# Altium project Rear_Power_Distribution.PrjPcb
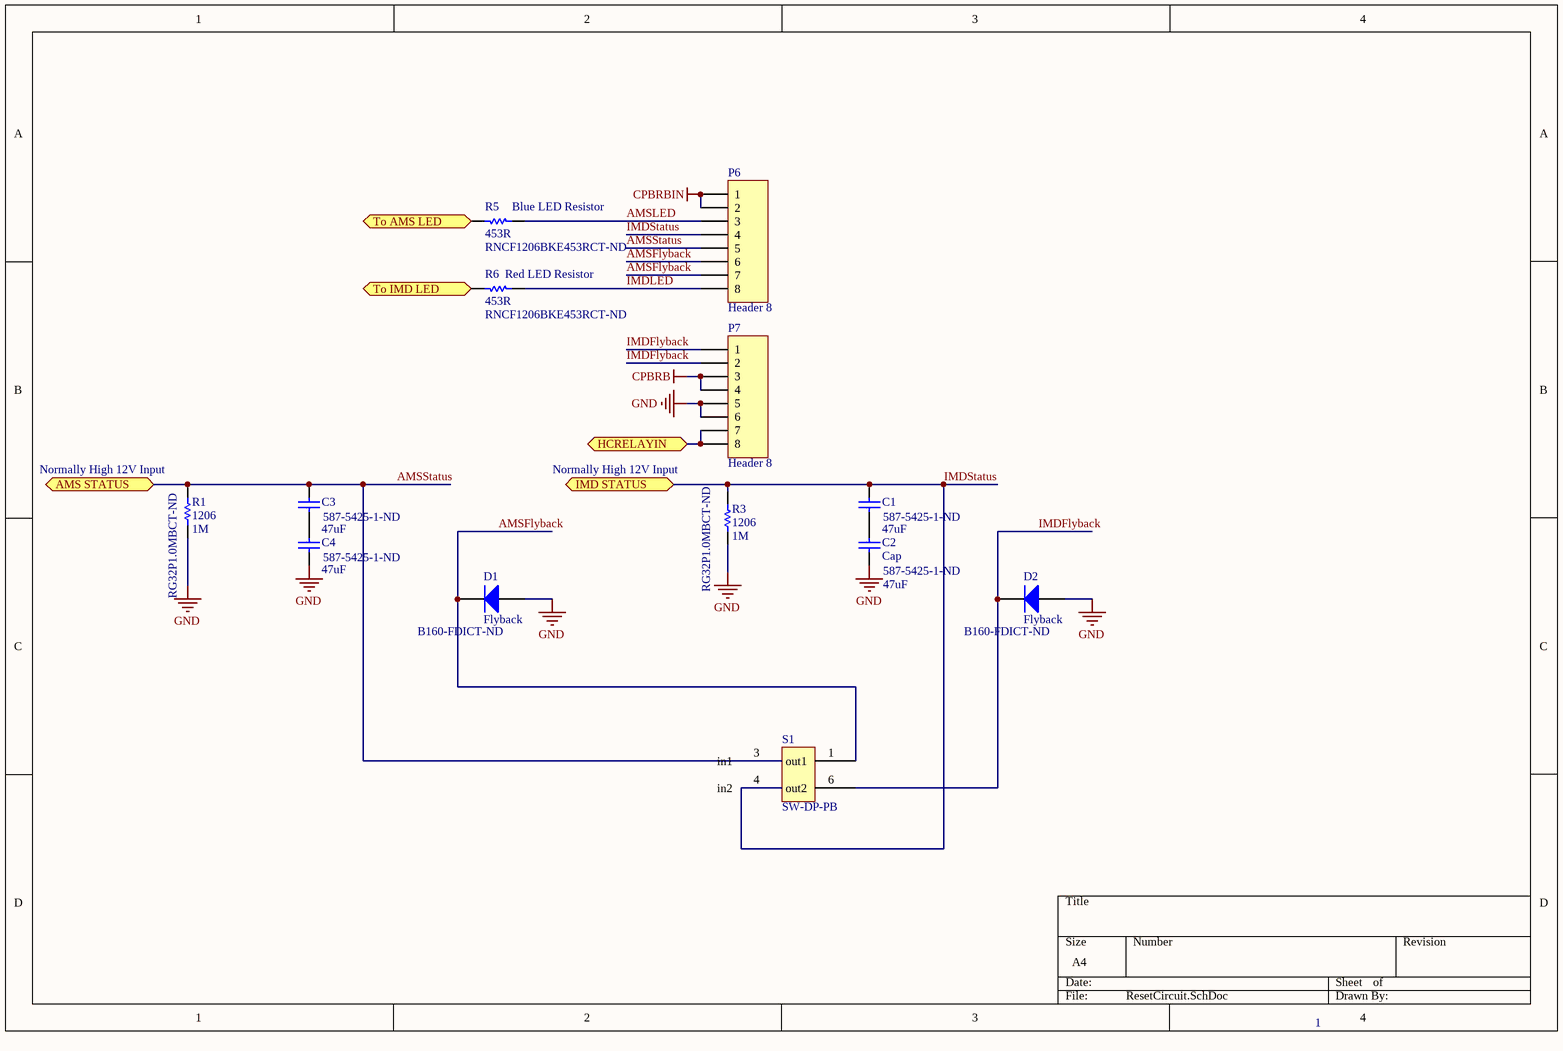
[diagram p0: ResetCircuit.SchDoc]
4 sheets, 55 parts. Net scope: flat (ports and power ports of the same name join across sheets).
Board file: RPD_top.PcbDoc
Sheets:
  ResetCircuit.SchDoc
  FuelPump.SchDoc
  Rear Power Dist.SchDoc
  Fusing_Connectors.SchDoc

## Sheet ResetCircuit.SchDoc
size A4; Date: 2017-12-21; DrawnBy: Tylynn Haddow; Revision: 2; DocumentName: Reset Circuit

### Parts
C1  value 47uF  Supplier Part Number 1: 587-5425-1-ND  [C1206]  (hidden comment: Cap)
C2  Cap  value 47uF  Supplier Part Number 1: 587-5425-1-ND  [C1206]
C3  value 47uF  Supplier Part Number 1: 587-5425-1-ND  [C1206]  (hidden comment: Cap)
C4  value 47uF  Supplier Part Number 1: 587-5425-1-ND  [C1206]  (hidden comment: Cap)
D1  Flyback  Supplier Part Number 1: B160-FDICT-ND  [DO-214AC, SMA]
D2  Flyback  Supplier Part Number 1: B160-FDICT-ND  [DO-214AC, SMA]
P6  Header 8  [HDR1X8]
P7  Header 8  [HDR1X8]
R1  1206  value 1M  Supplier Part Number 1: RG32P1.0MBCT-ND  [1206 (High Density)]
R3  1206  value 1M  Supplier Part Number 1: RG32P1.0MBCT-ND  [1206 (High Density)]
R5  Blue LED Resistor  value 453R  Supplier Part Number 1: RNCF1206BKE453RCT-ND  [C1206]
R6  Red LED Resistor  value 453R  Supplier Part Number 1: RNCF1206BKE453RCT-ND  [C1206]
S1  SW-DP-PB  [SW-DP-PB]

### Ports
AMS STATUS (bidir), HCRELAYIN (bidir), IMD STATUS (bidir), To AMS LED (bidir), To IMD LED (bidir)

### Nets
CPBRB: P7.3 P7.4
CPBRBIN: P6.1 P6.2
GND: C2.1 C4.1 D1.1(A) D2.1(A) P7.5 P7.6 R1.1 R3.1
AMSFlyback: D1.2(K) P6.6 P6.7 S1.1(out1)
AMSLED: P6.3 R5.2
AMSStatus: C3.2 P6.5 R1.2 S1.3(in1) ; port AMS STATUS
IMDFlyback: D2.2(K) P7.1 P7.2 S1.6(out2)
IMDLED: P6.8 R6.2
IMDStatus: C1.2 P6.4 R3.2 S1.4(in2) ; port IMD STATUS
NetC1_1: C1.1 C2.2
NetC3_1: C3.1 C4.2
NetP7_7: P7.7 P7.8 ; port HCRELAYIN
NetR5_1: R5.1 ; port To AMS LED
NetR6_1: R6.1 ; port To IMD LED

### Notes on the sheet
- (near R1) Normally High 12V Input
- Normally High 12V Input
- 1

### Library data of the parts
C1-C4 = Cap: Capacitor; Published: 8-Jun-2000; LatestRevisionDate: 17-Jul-2002; LatestRevisionNote: Re-released for DXP Platform.; PackageReference: RAD-0.3; Publisher: Altium Limited; PackageDescription: Radial Cap, Thru-Hole; 2 Leads; 0.3 in Pin Spacing
  C3 C4: Supplier 1: Digikey
D1 D2 = Diode: Default Diode; Published: 8-Jun-2000; LatestRevisionDate: 17-Jul-2002; LatestRevisionNote: Re-released for DXP Platform.; PackageVersion: Sep-1996; PackageReference: SMC; Publisher: Altium Limited; PackageDescription: DO-214-AB/SMC; 2 C-Bend Leads; Body 7.9 x 5.9 mm, inc. leads (LxW); Code_JEDEC: DO-214-AB; Supplier 1: Digi-Key
P6 = Header 8: Header, 8-Pin, A98338-ND; LatestRevisionDate: 17-Jul-2002; LatestRevisionNote: Re-released for DXP Platform.; Publisher: Altium Limited; Supplier Part Number 1: A98338-ND; Supplier 1: Digikey
P7 = Header 8: Header, 8-Pin A98338-ND; LatestRevisionDate: 17-Jul-2002; LatestRevisionNote: Re-released for DXP Platform.; Publisher: Altium Limited; Supplier Part Number 1: A98338-ND; Supplier 1: Digikey
R1 R3 R5 R6 = Res1: Resistor; Published: 8-Jun-2000; LatestRevisionDate: 17-Jul-2002; LatestRevisionNote: Re-released for DXP Platform.; PackageReference: AXIAL-0.3; Publisher: Altium Limited; PackageDescription: Axial Device, Thru-Hole; 2 Leads; 0.3 in Pin Spacing; Supplier 1: Digi-Key
S1 = SW-DP-PB: Supplier Part Number 1: CKN9865-ND; Supplier 1: Digikey

## Sheet FuelPump.SchDoc
size A4
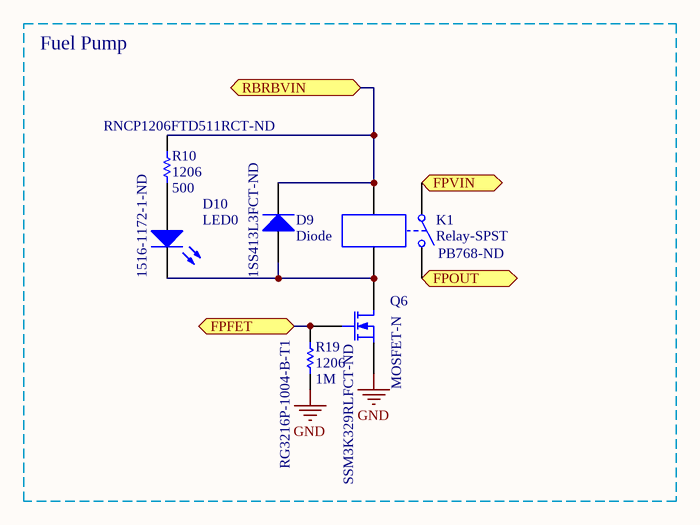
[diagram p1: FuelPump.SchDoc]

### Parts
D9  Diode  Supplier Part Number 1: 1SS413L3FCT-ND  [1SS413]
D10  LED0  Supplier Part Number 1: 1516-1172-1-ND  [C1206]
K1  Relay-SPST  Supplier Part Number 1: PB768-ND  [PB114012]
Q6  MOSFET-N  Supplier Part Number 1: SSM3K329RLFCT-ND  [SOT23f]
R10  1206  value 500  Supplier Part Number 1: RNCP1206FTD511RCT-ND  [C1206]
R19  1206  value 1M  Supplier Part Number 1: RG3216P-1004-B-T1  [1206 (High Density)]

### Blocks framed on the sheet
Fuel Pump: D9 D10 K1 Q6 R10 R19

### Ports
FPFET (bidir), FPOUT (bidir), FPVIN (bidir), RBRBVIN (bidir)

### Nets
GND: Q6.3(S) R19.1
NetD9_1: D9.1(A) D10.2(K) K1.4 Q6.1(D)
NetD9_2: D9.2(K) K1.3 R10.1 ; port RBRBVIN
NetD10_1: D10.1(A) R10.2
NetFPump1_1: K1.1 ; port FPVIN
NetK1_2: K1.2 ; port FPOUT
NetP1_6: Q6.2(G) R19.2 ; port FPFET

### Library data of the parts
D9 = Diode: Switching diode; Published: 8-Jun-2000; LatestRevisionDate: 17-Jul-2002; LatestRevisionNote: Re-released for DXP Platform.; PackageVersion: Sep-1996; PackageReference: SMC; Publisher: Altium Limited; PackageDescription: DO-214-AB/SMC; 2 C-Bend Leads; Body 7.9 x 5.9 mm, inc. leads (LxW); Code_JEDEC: DO-214-AB; Supplier 1: Digi-Key
D10 = LED0: Typical INFRARED GaAs LED; Published: 8-Jun-2000; LatestRevisionDate: 08-Jul-2005; LatestRevisionNote: Mech Layer 1 removed.; PackageReference: LED-0; Publisher: Altium Limited; PackageDescription: LED; 2 Leads; Supplier 1: Digi-Key
K1 = Relay-SPST: Single-Pole Single-Throw Relay; Published: 24-Mar-1999; LatestRevisionDate: 17-Jul-2002; LatestRevisionNote: Re-released for DXP Platform.; PackageReference: MODULE4; Publisher: Altium Limited; Supplier 1: Digi-Key
Q6 = MOSFET-N: N-Channel MOSFET; Published: 8-Jun-2000; LatestRevisionDate: 17-Jul-2002; LatestRevisionNote: Re-released for DXP Platform.; PackageVersion: 1995/1996; PackageReference: E3; Publisher: Altium Limited; PackageDescription: TO, Flat Index; 3 In-Line, Axial Leads; Body Dia. 4.6mm; Lead Dia. 0.5 mm (max); Supplier 1: Digi-Key
R10 R19 = Res1: Resistor; Published: 8-Jun-2000; LatestRevisionDate: 17-Jul-2002; LatestRevisionNote: Re-released for DXP Platform.; PackageReference: AXIAL-0.3; Publisher: Altium Limited; PackageDescription: Axial Device, Thru-Hole; 2 Leads; 0.3 in Pin Spacing; Supplier 1: Digi-Key

## Sheet Rear Power Dist.SchDoc
size A

## Sheet Fusing_Connectors.SchDoc
size A3
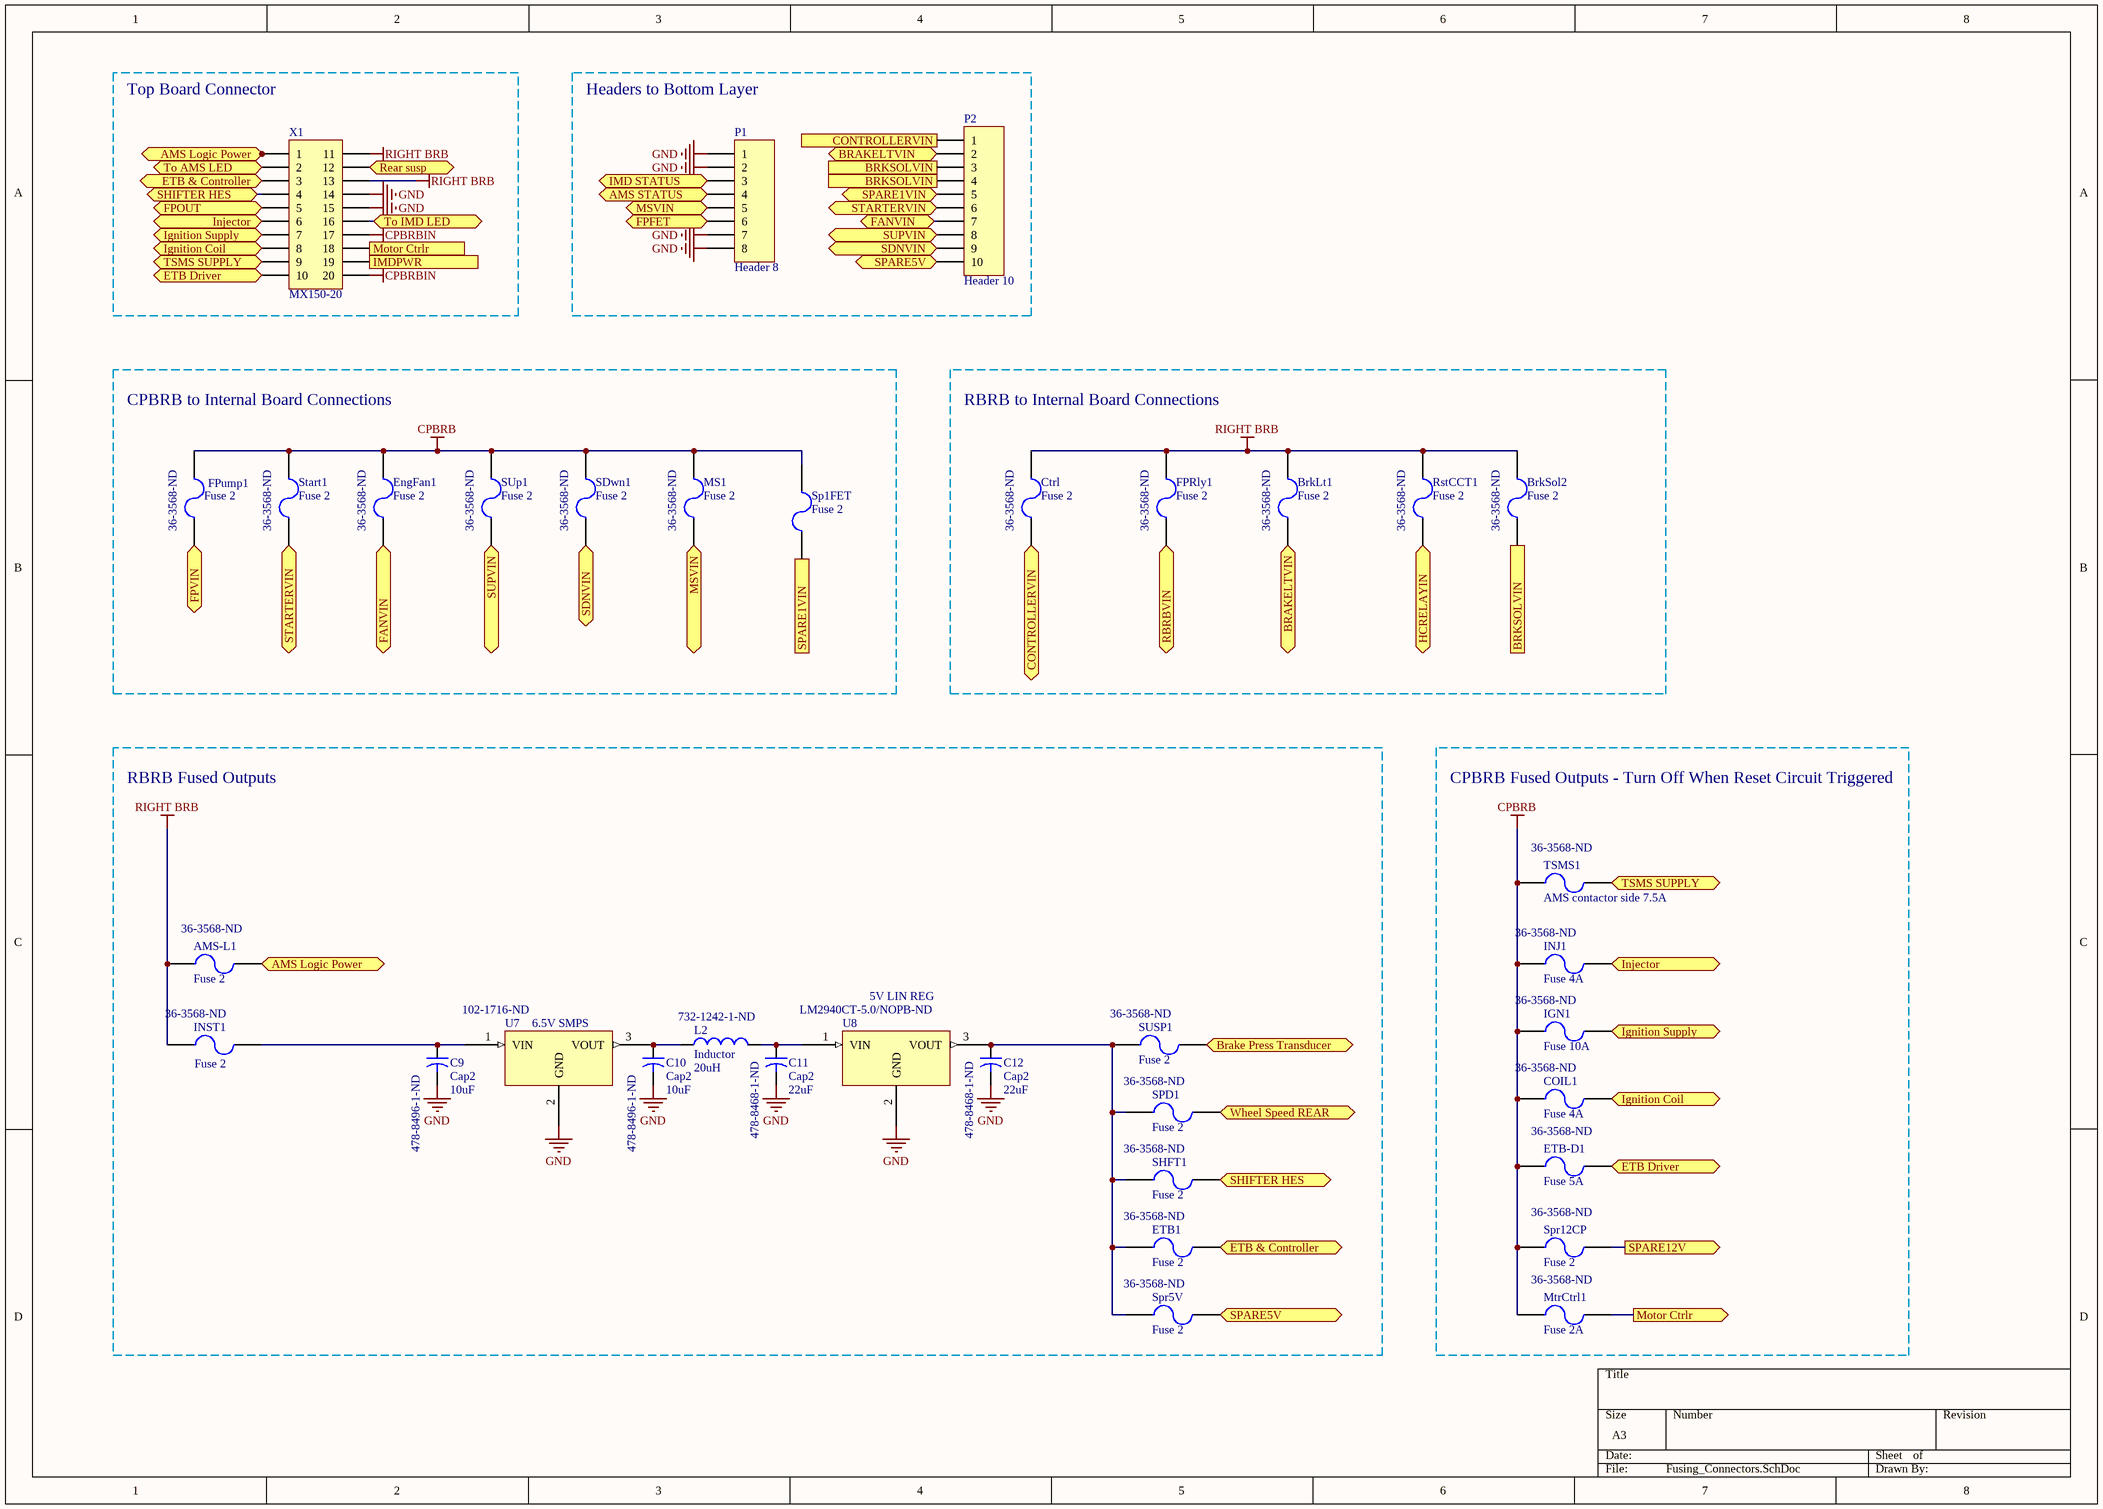
[diagram p2: Fusing_Connectors.SchDoc]

### Parts
AMS-L1  Fuse 2  Supplier Part Number 1: 36-3568-ND  [Fuse Holder Mini ATC/ATO]
BrkLt1  Fuse 2  Supplier Part Number 1: 36-3568-ND  [FUSE HOLDER MINI ATC/ATO]
BrkSol2  Fuse 2  Supplier Part Number 1: 36-3568-ND  [FUSE HOLDER MINI ATC/ATO]
C9  Cap2  value 10uF  Supplier Part Number 1: 478-8496-1-ND  [C1206]
C10  Cap2  value 10uF  Supplier Part Number 1: 478-8496-1-ND  [C1206]
C11  Cap2  value 22uF  Supplier Part Number 1: 478-8468-1-ND  [1206]
C12  Cap2  value 22uF  Supplier Part Number 1: 478-8468-1-ND  [1206]
COIL1  Fuse 4A  Supplier Part Number 1: 36-3568-ND  [Fuse Holder Mini ATC/ATO]
Ctrl  Fuse 2  Supplier Part Number 1: 36-3568-ND  [FUSE HOLDER MINI ATC/ATO]
EngFan1  Fuse 2  Supplier Part Number 1: 36-3568-ND  [FUSE HOLDER MINI ATC/ATO]
ETB1  Fuse 2  Supplier Part Number 1: 36-3568-ND  [Fuse Holder Mini ATC/ATO]
ETB-D1  Fuse 5A  Supplier Part Number 1: 36-3568-ND  [Fuse Holder Mini ATC/ATO]
FPRly1  Fuse 2  Supplier Part Number 1: 36-3568-ND  [FUSE HOLDER MINI ATC/ATO]
FPump1  Fuse 2  Supplier Part Number 1: 36-3568-ND  [FUSE HOLDER MINI ATC/ATO]
IGN1  Fuse 10A  Supplier Part Number 1: 36-3568-ND  [Fuse Holder Mini ATC/ATO]
INJ1  Fuse 4A  Supplier Part Number 1: 36-3568-ND  [Fuse Holder Mini ATC/ATO]
INST1  Fuse 2  Supplier Part Number 1: 36-3568-ND  [Fuse Holder Mini ATC/ATO]
L2  Inductor  value 20uH  Supplier Part Number 1: 732-1242-1-ND  [FILTER INDUCTOR]
MS1  Fuse 2  Supplier Part Number 1: 36-3568-ND  [FUSE HOLDER MINI ATC/ATO]
MtrCtrl1  Fuse 2A  Supplier Part Number 1: 36-3568-ND  [Fuse Holder Mini ATC/ATO]
P1  Header 8  [HDR1X8]
P2  Header 10  [HDR1X10]
RstCCT1  Fuse 2  Supplier Part Number 1: 36-3568-ND  [FUSE HOLDER MINI ATC/ATO]
SDwn1  Fuse 2  Supplier Part Number 1: 36-3568-ND  [FUSE HOLDER MINI ATC/ATO]
SHFT1  Fuse 2  Supplier Part Number 1: 36-3568-ND  [FUSE HOLDER MINI ATC/ATO]
Sp1FET  Fuse 2  [FUSE HOLDER MINI ATC/ATO]
SPD1  Fuse 2  Supplier Part Number 1: 36-3568-ND  [Fuse Holder Mini ATC/ATO]
Spr5V  Fuse 2  Supplier Part Number 1: 36-3568-ND  [Fuse Holder Mini ATC/ATO]
Spr12CP  Fuse 2  Supplier Part Number 1: 36-3568-ND  [Fuse Holder Mini ATC/ATO]
Start1  Fuse 2  Supplier Part Number 1: 36-3568-ND  [FUSE HOLDER MINI ATC/ATO]
SUp1  Fuse 2  Supplier Part Number 1: 36-3568-ND  [FUSE HOLDER MINI ATC/ATO]
SUSP1  Fuse 2  Supplier Part Number 1: 36-3568-ND  [Fuse Holder Mini ATC/ATO]
TSMS1  AMS contactor side 7.5A  Supplier Part Number 1: 36-3568-ND  [Fuse Holder Mini ATC/ATO]
U7  6.5V SMPS  Supplier Part Number 1: 102-1716-ND  [V7806-1000]
U8  5V LIN REG  Supplier Part Number 1: LM2940CT-5.0/NOPB-ND  [TO-220-3]
X1  MX150-20  [20 Pin MX150]

### Blocks framed on the sheet
Top Board Connector: X1
Headers to Bottom Layer: P1 P2
CPBRB to Internal Board Connections: EngFan1 FPump1 MS1 SDwn1 Sp1FET Start1 SUp1
RBRB to Internal Board Connections: BrkLt1 BrkSol2 Ctrl FPRly1 RstCCT1
RBRB Fused Outputs: AMS-L1 C9-C12 ETB1 INST1 L2 SHFT1 SPD1 Spr5V SUSP1 U7 U8
CPBRB Fused Outputs - Turn Off When Reset Circuit Triggered: COIL1 ETB-D1 IGN1 INJ1 MtrCtrl1 Spr12CP TSMS1

### Ports
AMS Logic Power (bidir), AMS STATUS (bidir), Brake Press Transducer (bidir), BRAKELTVIN (bidir), BRKSOLVIN, CONTROLLERVIN, CONTROLLERVIN (bidir), ETB & Controller (bidir), ETB Driver (bidir), FANVIN (bidir), FPFET (bidir), FPOUT (bidir), FPVIN (bidir), HCRELAYIN (bidir), Ignition Coil (bidir), Ignition Supply (bidir), IMD STATUS (bidir), IMDPWR (out), Injector (bidir), Motor Ctrlr (out), MSVIN (bidir), RBRBVIN (bidir), Rear susp (bidir), SDNVIN (bidir), SHIFTER HES (bidir), SPARE1VIN, SPARE1VIN (bidir), SPARE5V (bidir), SPARE12V (out), STARTERVIN (bidir), SUPVIN (bidir), To AMS LED (bidir), To IMD LED (bidir), TSMS SUPPLY (bidir), Wheel Speed REAR (bidir)

### Nets
CPBRB: COIL1.2 EngFan1.2 ETB-D1.2 FPump1.2 IGN1.2 INJ1.2 MS1.2 MtrCtrl1.2 SDwn1.2 Sp1FET.2 Spr12CP.2 Start1.2 SUp1.2 TSMS1.2
CPBRBIN: X1.17 X1.20
GND: C9.2 C10.2 C11.2 C12.2 P1.1 P1.2 P1.7 P1.8 U7.2(GND) U8.2(GND) X1.14 X1.15
RIGHT BRB: AMS-L1.2 BrkLt1.2 BrkSol2.2 Ctrl.2 FPRly1.2 INST1.2 RstCCT1.2 X1.11 X1.13
AMSStatus: P1.4 ; port AMS STATUS
IMDStatus: P1.3 ; port IMD STATUS
NetAMS-L1_1: AMS-L1.1 ; port AMS Logic Power
NetBrkLt1_1: BrkLt1.1 P2.2 ; port BRAKELTVIN
NetBrkSol2_1: BrkSol2.1 P2.3 P2.4 ; port BRKSOLVIN
NetC9_1: C9.1 INST1.1 U7.1(VIN)
NetC10_1: C10.1 L2.1 U7.3(VOUT)
NetC11_1: C11.1 L2.2 U8.1(VIN)
NetC12_1: C12.1 ETB1.2 SHFT1.2 SPD1.2 Spr5V.2 SUSP1.2 U8.3(VOUT)
NetCOIL1_1: COIL1.1 X1.8 ; port Ignition Coil
NetCtrl_1: Ctrl.1 P2.1 ; port CONTROLLERVIN
NetD9_2: FPRly1.1 ; port RBRBVIN
NetEngFan1_1: EngFan1.1 P2.7 ; port FANVIN
NetETB1_1: ETB1.1 X1.3 ; port ETB & Controller
NetETB-D1_1: ETB-D1.1 X1.10 ; port ETB Driver
NetFPump1_1: FPump1.1 ; port FPVIN
NetIGN1_1: IGN1.1 X1.7 ; port Ignition Supply
NetINJ1_1: INJ1.1 X1.6 ; port Injector
NetK1_2: X1.5 ; port FPOUT
NetMS1_1: MS1.1 P1.5 ; port MSVIN
NetMtrCtrl1_1: MtrCtrl1.1 X1.18 ; port Motor Ctrlr
NetP1_6: P1.6 ; port FPFET
NetP2_5: P2.5 Sp1FET.1 ; port SPARE1VIN
NetP2_6: P2.6 Start1.1 ; port STARTERVIN
NetP2_8: P2.8 SUp1.1 ; port SUPVIN
NetP2_9: P2.9 SDwn1.1 ; port SDNVIN
NetP2_10: P2.10 Spr5V.1 ; port SPARE5V
NetP7_7: RstCCT1.1 ; port HCRELAYIN
NetR5_1: X1.2 ; port To AMS LED
NetR6_1: X1.16 ; port To IMD LED
NetSHFT1_1: SHFT1.1 X1.4 ; port SHIFTER HES
NetSPD1_1: SPD1.1 ; port Wheel Speed REAR
NetSpr12CP_1: Spr12CP.1 ; port SPARE12V
NetSUSP1_1: SUSP1.1 ; port Brake Press Transducer
NetTSMS1_1: TSMS1.1 X1.9 ; port TSMS SUPPLY
NetX1_12: X1.12 ; port Rear susp
NetX1_19: X1.19 ; port IMDPWR

Not connected (* = marked no-connect by the designer): X1 1

### Library data of the parts
AMS-L1 BrkLt1 BrkSol2 Ctrl EngFan1 ETB1 FPump1 INST1 RstCCT1 SDwn1 SHFT1 Sp1FET SPD1 Spr5V Start1 SUp1 SUSP1 = Fuse 2: Fuse; Published: 8-Jun-2000; LatestRevisionDate: 17-Jul-2002; LatestRevisionNote: Re-released for DXP Platform.; PackageReference: PIN-W2/E2.8; Publisher: Altium Limited; PackageDescription: Thru-Hole; 2 Leads; Supplier 1: Digi-Key
  AMS-L1 ETB1 INST1 SHFT1 SPD1 Spr5V SUSP1: Supplier 2: Digi-Key
  Sp1FET: Supplier Part Number 1: 36-3568-ND
C9 = Cap2: Capacitor. Ceramic 10uF 50V rating recommended, place close to pin; Published: 23-Sep-2002; PackageReference: CAPR5-4X5; Publisher: Altium Limited; PackageDescription: Capacitor; 2 Leads; Supplier 1: Digi-Key
C10 = Cap2: Capacitor. Ceramic 10uF 16V recommended. place close to pin; Published: 23-Sep-2002; PackageReference: CAPR5-4X5; Publisher: Altium Limited; PackageDescription: Capacitor; 2 Leads; Supplier 1: Digi-Key
C11 C12 = Cap2: Capacitor; Published: 23-Sep-2002; PackageReference: CAPR5-4X5; Publisher: Altium Limited; PackageDescription: Capacitor; 2 Leads; Supplier 1: Digi-Key
COIL1 = Fuse 2: Fuse Ignition Coil 4A; Published: 8-Jun-2000; LatestRevisionDate: 17-Jul-2002; LatestRevisionNote: Re-released for DXP Platform.; PackageReference: PIN-W2/E2.8; Publisher: Altium Limited; PackageDescription: Thru-Hole; 2 Leads; Supplier 1: Digi-Key; Supplier 2: Digi-Key
ETB-D1 = Fuse 2: Fuse 5A ETB driver; Published: 8-Jun-2000; LatestRevisionDate: 17-Jul-2002; LatestRevisionNote: Re-released for DXP Platform.; PackageReference: PIN-W2/E2.8; Publisher: Altium Limited; PackageDescription: Thru-Hole; 2 Leads; Supplier 1: Digi-Key; Supplier 2: Digi-Key
FPRly1 = Fuse 2: Fuse Relay Coils; Published: 8-Jun-2000; LatestRevisionDate: 17-Jul-2002; LatestRevisionNote: Re-released for DXP Platform.; PackageReference: PIN-W2/E2.8; Publisher: Altium Limited; PackageDescription: Thru-Hole; 2 Leads; Supplier 1: Digi-Key
IGN1 = Fuse 2: Fuse 10A ignition; Published: 8-Jun-2000; LatestRevisionDate: 17-Jul-2002; LatestRevisionNote: Re-released for DXP Platform.; PackageReference: PIN-W2/E2.8; Publisher: Altium Limited; PackageDescription: Thru-Hole; 2 Leads; Supplier 1: Digi-Key; Supplier 2: Digi-Key
INJ1 = Fuse 2: Published: 8-Jun-2000; LatestRevisionDate: 17-Jul-2002; LatestRevisionNote: Re-released for DXP Platform.; PackageReference: PIN-W2/E2.8; Publisher: Altium Limited; PackageDescription: Thru-Hole; 2 Leads; Supplier 1: Digi-Key; Supplier 2: Digi-Key
L2 = Inductor: Code_IEC: 1005; Published: 8-Jun-2000; LatestRevisionDate: 29-May-2009; LatestRevisionNote: IPC-7351 Footprint Added.; PackageReference: 0402-A; Publisher: Altium Limited; PackageDescription: Chip Inductor; Code_JEITA: 0402; Supplier 1: Digi-Key
MS1 = Fuse 2: Microsquirt fuse; Published: 8-Jun-2000; LatestRevisionDate: 17-Jul-2002; LatestRevisionNote: Re-released for DXP Platform.; PackageReference: PIN-W2/E2.8; Publisher: Altium Limited; PackageDescription: Thru-Hole; 2 Leads; Supplier 1: Digi-Key
MtrCtrl1 = Fuse 2: Fuse 2A Motor Controller; Published: 8-Jun-2000; LatestRevisionDate: 17-Jul-2002; LatestRevisionNote: Re-released for DXP Platform.; PackageReference: PIN-W2/E2.8; Publisher: Altium Limited; PackageDescription: Thru-Hole; 2 Leads; Supplier 1: Digi-Key; Supplier 2: Digi-Key
P1 = Header 8: Header, 8-Pin; LatestRevisionDate: 17-Jul-2002; LatestRevisionNote: Re-released for DXP Platform.; Publisher: Altium Limited; Supplier Part Number 1: 952-2121-ND; Supplier 1: Digi-Key
P2 = Header 10: Header, 10-Pin; LatestRevisionDate: 17-Jul-2002; LatestRevisionNote: Re-released for DXP Platform.; Publisher: Altium Limited; Supplier Part Number 1: 952-2121-ND
Spr12CP = Fuse 2: Spare Fuse; Published: 8-Jun-2000; LatestRevisionDate: 17-Jul-2002; LatestRevisionNote: Re-released for DXP Platform.; PackageReference: PIN-W2/E2.8; Publisher: Altium Limited; PackageDescription: Thru-Hole; 2 Leads; Supplier 1: Digi-Key; Supplier 2: Digi-Key
TSMS1 = Fuse 2: Fuse 7.5A; Published: 8-Jun-2000; LatestRevisionDate: 17-Jul-2002; LatestRevisionNote: Re-released for DXP Platform.; PackageReference: PIN-W2/E2.8; Publisher: Altium Limited; PackageDescription: Thru-Hole; 2 Leads; Supplier 1: Digi-Key; Supplier 2: Digi-Key
U7 U8 = Component_1: Supplier 1: Digi-Key
X1 = Header 10X2A: Header, 10-Pin, Dual row; LatestRevisionDate: 17-Jul-2002; LatestRevisionNote: Re-released for DXP Platform.; Publisher: Altium Limited

## Nets that join several sheets
CPBRB: ResetCircuit (P7.3 P7.4), Fusing_Connectors (14 pins)
CPBRBIN: ResetCircuit (P6.1 P6.2), Fusing_Connectors (X1.17 X1.20)
GND: ResetCircuit (8 pins), FuelPump (Q6.3 R19.1), Fusing_Connectors (12 pins)
AMSStatus: ResetCircuit (C3.2 P6.5 R1.2 S1.3), Fusing_Connectors (P1.4)
IMDStatus: ResetCircuit (C1.2 P6.4 R3.2 S1.4), Fusing_Connectors (P1.3)
NetD9_2: FuelPump (D9.2 K1.3 R10.1), Fusing_Connectors (FPRly1.1)
NetFPump1_1: FuelPump (K1.1), Fusing_Connectors (FPump1.1)
NetK1_2: FuelPump (K1.2), Fusing_Connectors (X1.5)
NetP1_6: FuelPump (Q6.2 R19.2), Fusing_Connectors (P1.6)
NetP7_7: ResetCircuit (P7.7 P7.8), Fusing_Connectors (RstCCT1.1)
NetR5_1: ResetCircuit (R5.1), Fusing_Connectors (X1.2)
NetR6_1: ResetCircuit (R6.1), Fusing_Connectors (X1.16)